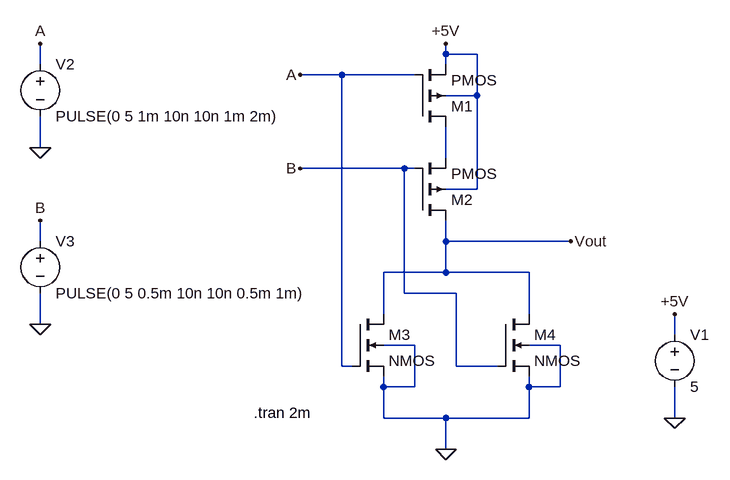
[diagram p0: schematic NOR.asc]
NOR.asc, the LTspice schematic file:
Version 4
SHEET 1 880 788
WIRE 256 32 256 16
WIRE 304 32 256 32
WIRE -368 48 -368 16
WIRE 256 48 256 32
WIRE 96 64 32 64
WIRE 208 64 96 64
WIRE 304 96 304 32
WIRE 304 96 256 96
WIRE -368 176 -368 128
WIRE 256 192 256 144
WIRE 192 208 32 208
WIRE 208 208 192 208
WIRE 304 240 304 96
WIRE 304 240 256 240
WIRE -368 320 -368 288
WIRE 256 320 256 288
WIRE 448 320 256 320
WIRE 256 368 256 320
WIRE 256 368 160 368
WIRE 384 368 256 368
WIRE 192 400 192 208
WIRE 272 400 192 400
WIRE 160 432 160 368
WIRE 384 432 384 368
WIRE -368 448 -368 400
WIRE 608 464 608 432
WIRE 208 480 160 480
WIRE 432 480 384 480
WIRE 96 512 96 64
WIRE 112 512 96 512
WIRE 272 512 272 400
WIRE 336 512 272 512
WIRE 160 544 160 528
WIRE 208 544 208 480
WIRE 208 544 160 544
WIRE 384 544 384 528
WIRE 432 544 432 480
WIRE 432 544 384 544
WIRE 160 592 160 544
WIRE 256 592 160 592
WIRE 384 592 384 544
WIRE 384 592 256 592
WIRE 608 592 608 544
WIRE 256 640 256 592
FLAG 608 432 +5V
FLAG 608 592 0
FLAG 256 16 +5V
FLAG 256 640 0
FLAG 448 320 Vout
FLAG 32 64 A
FLAG 32 208 B
FLAG -368 448 0
FLAG -368 176 0
FLAG -368 16 A
FLAG -368 288 B
SYMBOL pmos4 208 144 M180
SYMATTR InstName M1
SYMBOL pmos4 208 288 M180
SYMATTR InstName M2
SYMBOL voltage 608 448 R0
WINDOW 123 0 0 Left 0
WINDOW 39 0 0 Left 0
SYMATTR InstName V1
SYMATTR Value 5
SYMBOL nmos4 112 432 R0
SYMATTR InstName M3
SYMBOL nmos4 336 432 R0
SYMATTR InstName M4
SYMBOL voltage -368 32 R0
WINDOW 123 0 0 Left 0
WINDOW 39 0 0 Left 0
SYMATTR InstName V2
SYMATTR Value PULSE(0 5 1m 10n 10n 1m 2m)
SYMBOL voltage -368 304 R0
WINDOW 123 0 0 Left 0
WINDOW 39 0 0 Left 0
SYMATTR InstName V3
SYMATTR Value PULSE(0 5 0.5m 10n 10n 0.5m 1m)
TEXT -40 584 Left 2 !.tran 2m

The netlist it stands for:
* NOR.asc
M1 N001 A +5V +5V PMOS
M2 Vout B N001 +5V PMOS
V1 +5V 0 5
M3 Vout A 0 0 NMOS
M4 Vout B 0 0 NMOS
V2 A 0 PULSE(0 5 1m 10n 10n 1m 2m)
V3 B 0 PULSE(0 5 0.5m 10n 10n 0.5m 1m)
.model NMOS NMOS
.model PMOS PMOS
.lib standard.mos
.tran 2m
.backanno
.end